# EAGLE design StickIt-DIPSwitch (EAGLE 5.11)
AUTHOR: Dave Vandenbout / XESS Corp.; VERSION#: 1.0
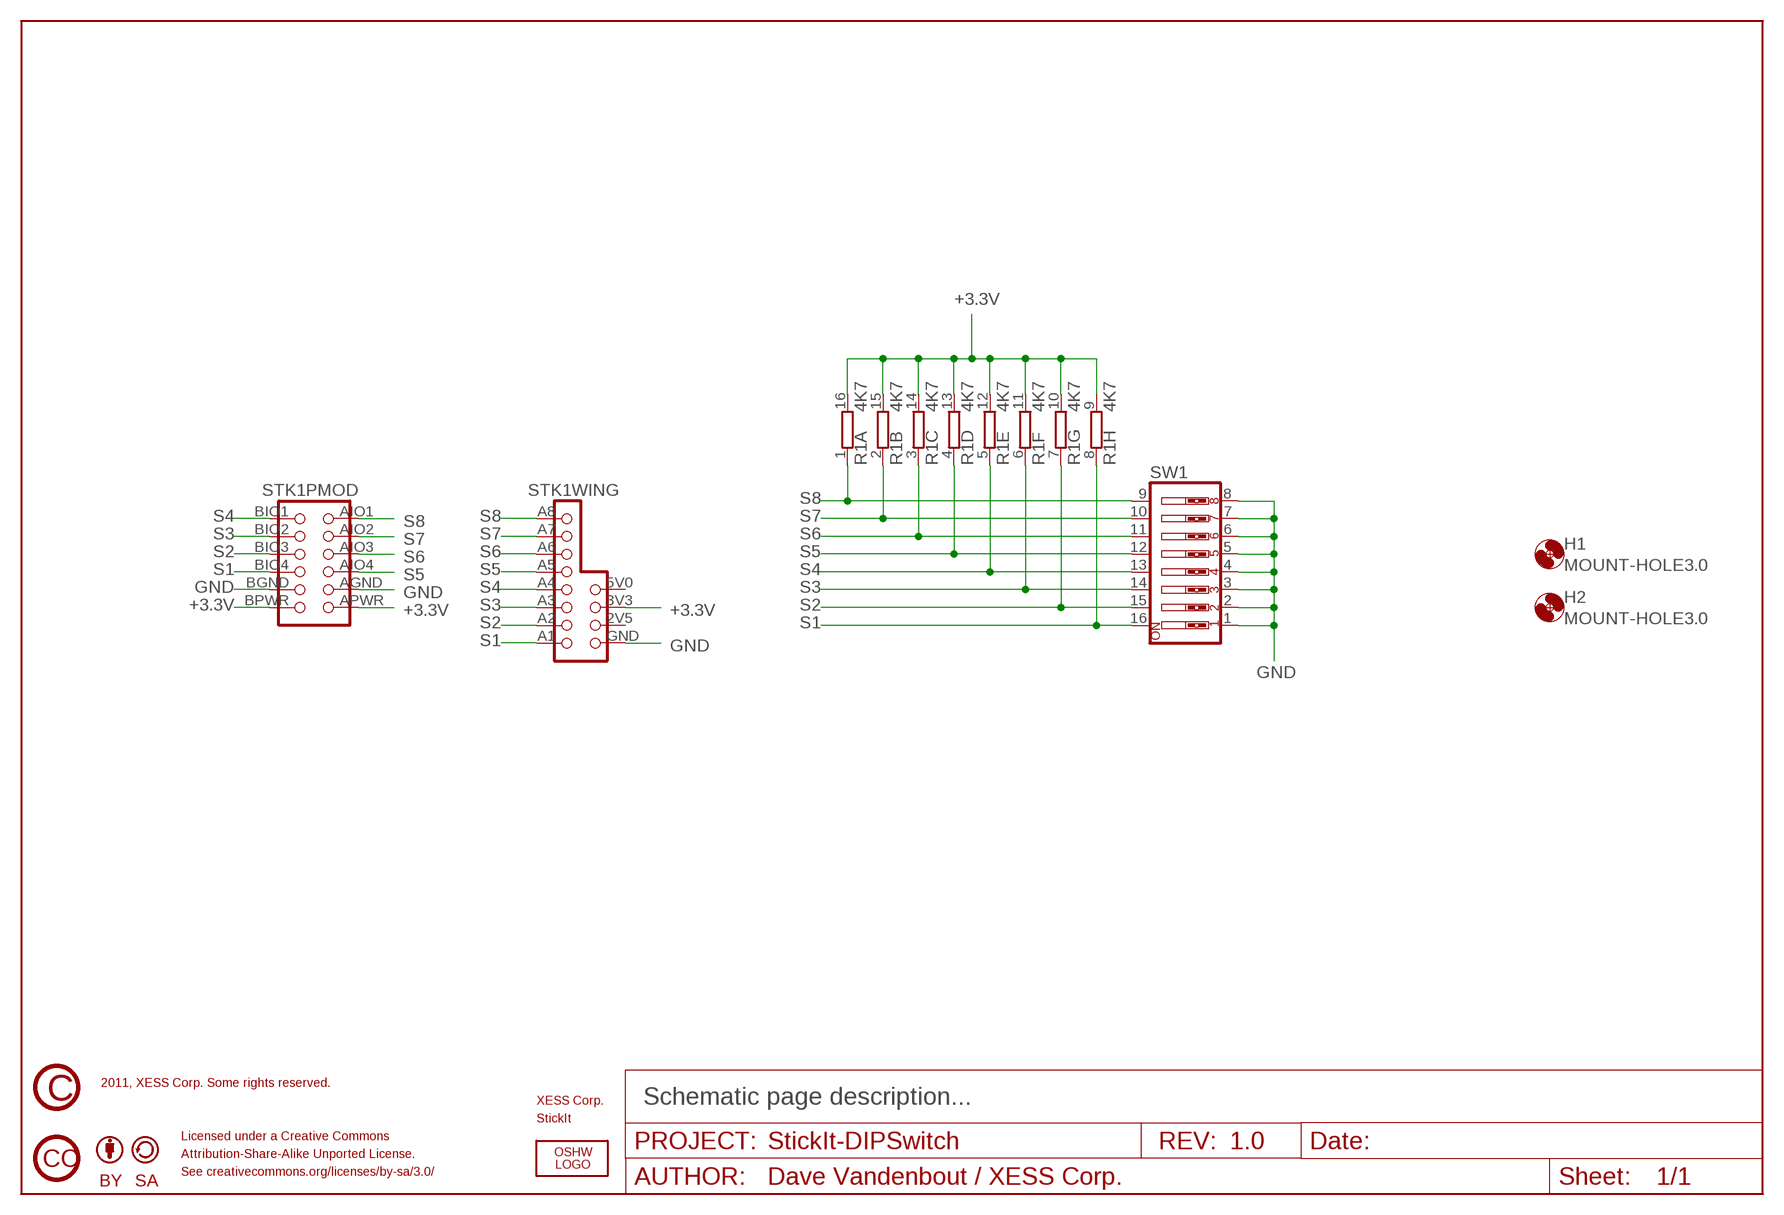
[diagram p0: schematic, sheet 1]

## Parts
H1  MOUNT-HOLE3.0  [3,0]
H2  MOUNT-HOLE3.0  [3,0]
LOGO1  OSHW_LOGO_FILLX0150-NT  [OSHW_FILLX150_NOTEXT]
R1  4K7  RES8742  [742C163]
STK1  STICKIT-HEADER  STICKIT-HEADER1  [STICKIT-HEADER1]
SW1  SW_DIP-8  [EDG-08]
U$1  LOGO-STICKIT700X200  [LOGO-STICKIT-700X200]
U$2  CC_CC  [CC_CC]
U$3  CC_BY  [CC_BY]
U$4  CC_SA  [CC_SA]
U$5  CC_COPYRIGHT  [CC_COPYRIGHT]
U$6  LOGO-XESS  LOGO-XESS700X120  [LOGO-XESS-700X120]

## Nets
+3.3V: R1.9 R1.10 R1.11 R1.12 R1.13 R1.14 R1.15 R1.16 STK1.3V3(WING:3V3) STK1.APWR(PMOD:APWR) STK1.BPWR(PMOD:BPWR)
GND: STK1.AGND(PMOD:AGND) STK1.BGND(PMOD:BGND) STK1.GND(WING:GND) SW1.1 SW1.2 SW1.3 SW1.4 SW1.5 SW1.6 SW1.7 SW1.8
S1: R1.8 STK1.A1(WING:A1) STK1.BIO4(PMOD:BIO4) SW1.16
S2: R1.7 STK1.A2(WING:A2) STK1.BIO3(PMOD:BIO3) SW1.15
S3: R1.6 STK1.A3(WING:A3) STK1.BIO2(PMOD:BIO2) SW1.14
S4: R1.5 STK1.A4(WING:A4) STK1.BIO1(PMOD:BIO1) SW1.13
S5: R1.4 STK1.A5(WING:A5) STK1.AIO4(PMOD:AIO4) SW1.12
S6: R1.3 STK1.A6(WING:A6) STK1.AIO3(PMOD:AIO3) SW1.11
S7: R1.2 STK1.A7(WING:A7) STK1.AIO2(PMOD:AIO2) SW1.10
S8: R1.1 STK1.A8(WING:A8) STK1.AIO1(PMOD:AIO1) SW1.9
Unconnected: STK1.2V5(WING:2V5) STK1.5V0(WING:5V)

## Notes on the sheet
- 2011, XESS Corp. Some rights reserved.
- Schematic page description...
- Licensed under a Creative Commons
- Attribution-Share-Alike Unported License.
- See creativecommons.org/licenses/by-sa/3.0/

## Library data of the parts
H1 H2 = holes:MOUNT-HOLE: MOUNTING HOLE with drill center marker
LOGO1 = oshw-logo:OSHW_LOGO_FILL
R1 = xess:RES8: Resistor 8-pack Package of eight resistors.; DIGIKEY#: 742C163???JPCT-ND; MANF: CTS Resistor Products; MANF#: 742C163???JPTR; MOUSER#: 774-742C163???JP
STK1 = xess:STICKIT-HEADER: StickIt Header Combined PMOD and Papilio Wing header for use on StickIt add-on boards.
SW1 = special:SW_DIP-8: DIP SWITCH
U$1 = xess:LOGO-STICKIT
U$2 = xess:CC_CC
U$3 = xess:CC_BY
U$4 = xess:CC_SA
U$5 = xess:CC_COPYRIGHT
U$6 = xess:LOGO-XESS

## Net classes
1 power: clearance 0.254 mm

## Board
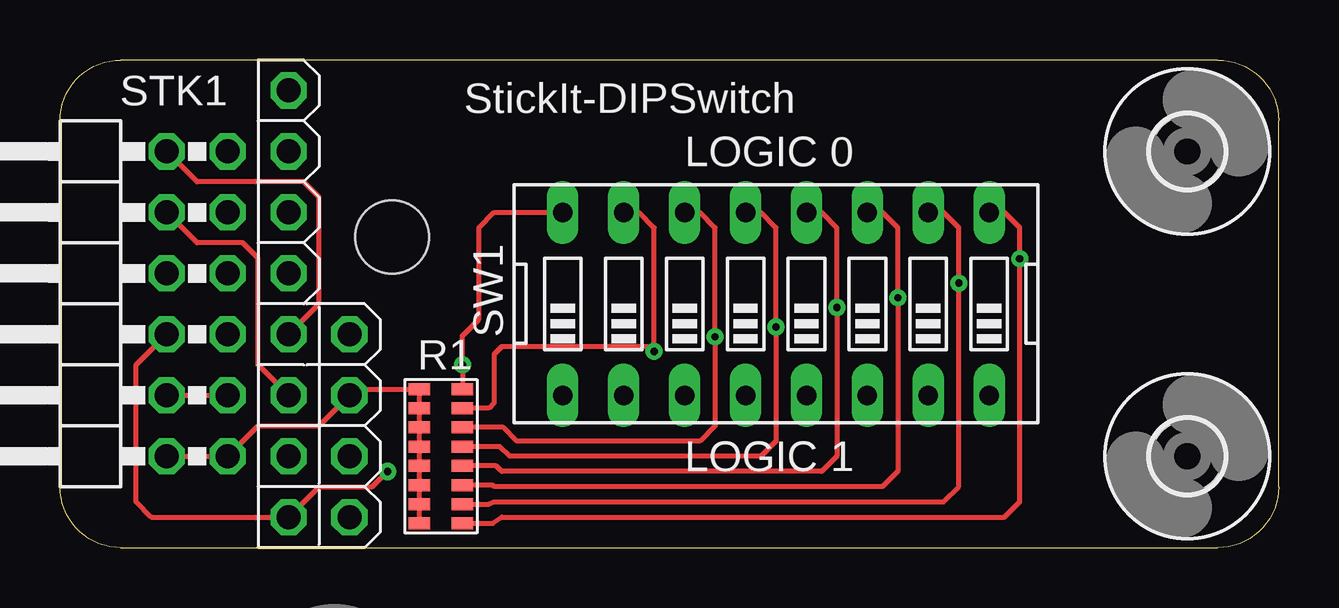
[diagram p1: board, top side]
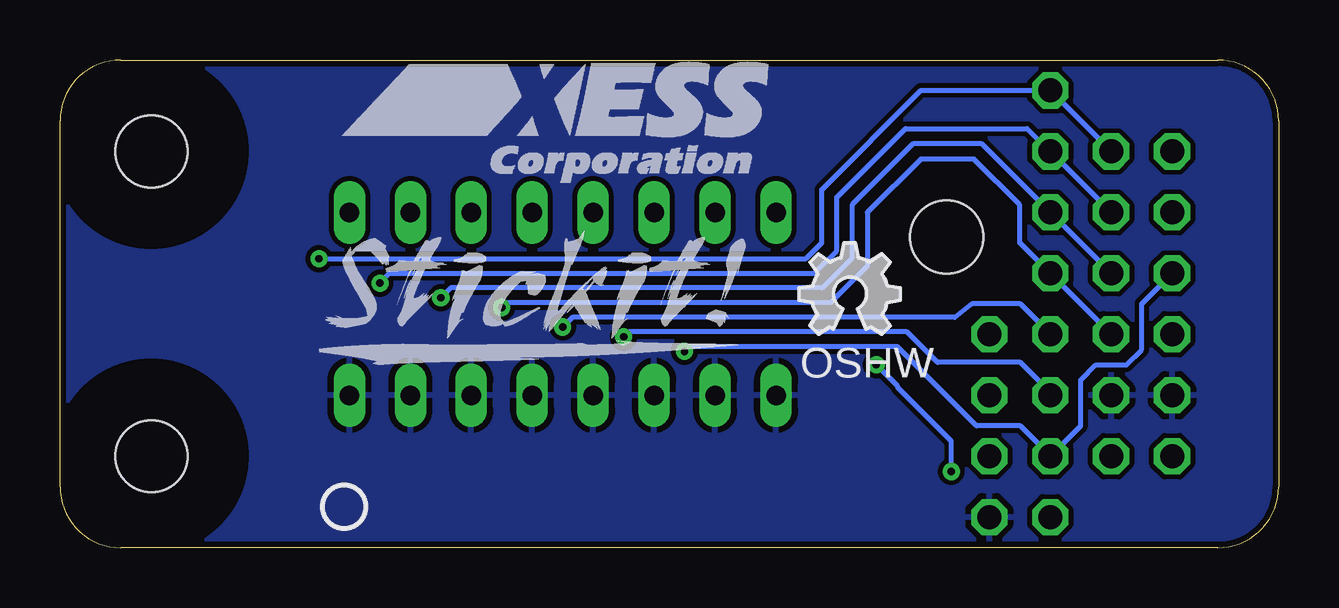
[diagram p2: board, bottom side, seen from below]

Size 50.8 x 20.32 mm. Coordinates in mm from the lower left corner, seen from the top.
Outline: 2.54,0 48.26,0 arc90 50.8,2.54 50.8,17.78 arc90 48.26,20.32 2.54,20.32 arc90 0,17.78 0,2.54 arc90 2.54,0
Copper layers (1*16): Top 0.035mm / dielectric 1.5mm / Bottom 0.035mm
Design rules "ITeadstudio_safe": minimum track width 8mil, minimum drill 12mil, track to track 8mil, track to pad 8mil, pad to pad 8mil, via to via 8mil, smd to smd 0mil, copper to edge 10mil, drill to drill 10mil, minimum pad ring 10mil, minimum via ring 8mil, stop-mask expansion 2mil, vias tented up to drill 100mil, thermal gap 10mil

### Footprints (pad centres in the part's own frame; a part is rotated, then mirrored left to right if it is on the bottom)
3,0 = hole 3: 0,0
742C163 = smd 0.5 x 0.9: 1 -2.8,-0.9; 2 -2,-0.9; 3 -1.2,-0.9; 4 -0.4,-0.9; 5 0.4,-0.9; 6 1.2,-0.9; 7 2,-0.9; 8 2.8,-0.9; 9 2.8,0.9; 10 2,0.9; 11 1.2,0.9; 12 0.4,0.9; 13 -0.4,0.9; 14 -1.2,0.9; 15 -2,0.9; 16 -2.8,0.9
STICKIT-HEADER1 = drill 1 octagon: 2V5 5.08,-15.24; 3V3 5.08,-12.7; 5V0 5.08,-10.16; A1 2.54,-17.78; A2 2.54,-15.24; A3 2.54,-12.7; A4 2.54,-10.16; A5 2.54,-7.62; A6 2.54,-5.08; A7 2.54,-2.54; A8 2.54,0; AGND 0,-12.7; AIO1 0,-2.54; AIO2 0,-5.08; AIO3 0,-7.62; AIO4 0,-10.16; APWR 0,-15.24; BGND -2.54,-12.7; BIO1 -2.54,-2.54; BIO2 -2.54,-5.08; BIO3 -2.54,-7.62; BIO4 -2.54,-10.16; BPWR -2.54,-15.24; GND 5.08,-17.78 | hole 3.048: 6.858,-6.096
EDG-08 = drill 0.813 long: 1 -8.89,-3.81; 2 -6.35,-3.81; 3 -3.81,-3.81; 4 -1.27,-3.81; 5 1.27,-3.81; 6 3.81,-3.81; 7 6.35,-3.81; 8 8.89,-3.81; 9 8.89,3.81; 10 6.35,3.81; 11 3.81,3.81; 12 1.27,3.81; 13 -1.27,3.81; 14 -3.81,3.81; 15 -6.35,3.81; 16 -8.89,3.81

### Placement (x,y rotation side)
H1  46.99,3.81 0 top
H2  46.99,16.51 0 top
LOGO1  20,8.89 0 bottom
R1  15.88,3.81 90 top
STK1  6.99,19.05 0 top
SW1  29.84,10.16 0 top
U$1  40.01,7.62 0 bottom
U$2  11.43,-14.61 0 top  (outside the outline)
U$3  18.41,-13.34 0 top  (outside the outline)
U$4  23.5,-13.34 0 top  (outside the outline)
U$5  11.43,-5.71 0 top  (outside the outline)
U$6  39.05,17.14 0 bottom

### Tracks (layer width: path | path; a pad name or v marks a point on that pad's centre or on a via)
+3.3V
  Top 0.203: STK1.BPWR STK1.APWR 8.26,5.08 10.79,5.08 STK1.3V3 12.32,6.61 R1.9 R1.10 R1.11 R1.12 R1.13 R1.14 R1.15 R1.16
GND
  Top 0.203: STK1.BGND STK1.AGND
  pour Bottom: 0,0 0,20.32 50.8,20.32 50.8,0
S1  (via drill 0.3)
  Top 0.203: 16.83,6.67 R1.8 v16.77,7.62 16.77,8.84 17.46,9.53 17.46,13.34 18.1,13.97 SW1.16 | STK1.BIO4 3.17,7.62 3.17,1.91 3.81,1.27 STK1.A1 10.79,2.54 13.02,2.54 v13.65,3.17
  Bottom 0.203: v13.65,3.17 13.65,4.45 15.88,6.67 15.88,6.72 v16.77,7.62
S2  (via drill 0.3)
  Top 0.203: SW1.15 24.13,13.97 24.77,13.34 v24.77,8.18 24.56,8.38 18.41,8.38 18.1,8.06 18.1,6.03 17.88,5.81 R1.7
  Bottom 0.203: v24.77,8.18 24.56,8.38 15.9,8.38 12.6,5.08 10.77,5.08 9.53,3.83 STK1.A2 8.26,5.08 8.26,6.99 7.62,7.62 6.35,7.62 5.71,8.26 5.71,10.16 STK1.BIO3
S3  (via drill 0.3)
  Top 0.203: SW1.14 26.67,13.97 27.3,13.34 v27.3,8.79 27.3,5.08 26.67,4.45 19.05,4.45 18.48,5.01 R1.6 | STK1.BIO2 5.71,12.7 7.62,12.7 8.26,12.06 8.26,7.62 STK1.A3
  Bottom 0.203: STK1.A3 9.53,6.48 10.77,7.72 14.22,7.72 15.49,8.99 27.1,8.99 v27.3,8.79
S4  (via drill 0.3)
  Top 0.203: SW1.13 29.21,13.97 29.84,13.34 v29.84,9.2 29.84,4.45 29.21,3.81 18.73,3.81 18.33,4.21 R1.5 | STK1.BIO1 5.71,15.24 10.16,15.24 10.79,14.61 10.79,10.16 STK1.A4
  Bottom 0.203: STK1.A4 9.53,8.91 10.77,10.16 12.79,10.16 13.5,9.6 29.44,9.6 v29.84,9.2
S5  (via drill 0.3)
  Top 0.203: SW1.12 31.75,13.97 32.38,13.34 v32.38,10.01 32.38,3.81 31.75,3.17 18.41,3.17 18.18,3.41 R1.4
  Bottom 0.203: v32.38,10.01 32.18,10.21 18.68,10.21 17.14,11.75 17.14,13.97 14.92,16.19 12.7,16.19 10.79,14.29 10.79,12.7 STK1.A5 STK1.AIO4
S6  (via drill 0.3)
  Top 0.203: SW1.11 34.29,13.97 34.92,13.34 v34.92,10.41 34.92,3.17 34.29,2.54 18.1,2.54 18.03,2.61 R1.3
  Bottom 0.203: STK1.A6 9.7,13.97 | v34.92,10.41 34.52,10.82 19.02,10.82 17.78,12.06 17.78,14.29 15.24,16.83 12.38,16.83 STK1.A6 | STK1.AIO3 STK1.A6
S7  (via drill 0.3)
  Top 0.203: SW1.10 36.83,13.97 37.47,13.34 v37.47,11.02 37.47,2.54 36.83,1.91 18.1,1.91 17.88,1.81 R1.2
  Bottom 0.203: v37.47,11.02 37.06,11.43 19.37,11.43 18.41,12.38 18.41,14.61 15.56,17.46 10.48,17.46 STK1.A7 | STK1.A7 9.6,16.51 | STK1.A7 STK1.AIO2
S8  (via drill 0.3)
  Top 0.203: SW1.9 39.37,13.97 40.01,13.34 v40.01,12.04 40.01,1.91 39.37,1.27 18.41,1.27 18.04,1.01 R1.1
  Bottom 0.203: v40.01,12.04 19.71,12.04 19.05,12.7 19.05,14.92 14.92,19.05 STK1.A8 STK1.AIO1

### Text on the board
tPlace: LOGIC 0 | LOGIC 1
bPlace: OSHW
tDocu: 2011, XESS Corp. Some rights reserved. | Licensed under a Creative Commons | Attribution-Share-Alike Unported License. | See creativecommons.org/licenses/by-sa/3.0/